# EAGLE design Grove Base HAT For Raspberry Pi Zero (EAGLE 9.2.2)
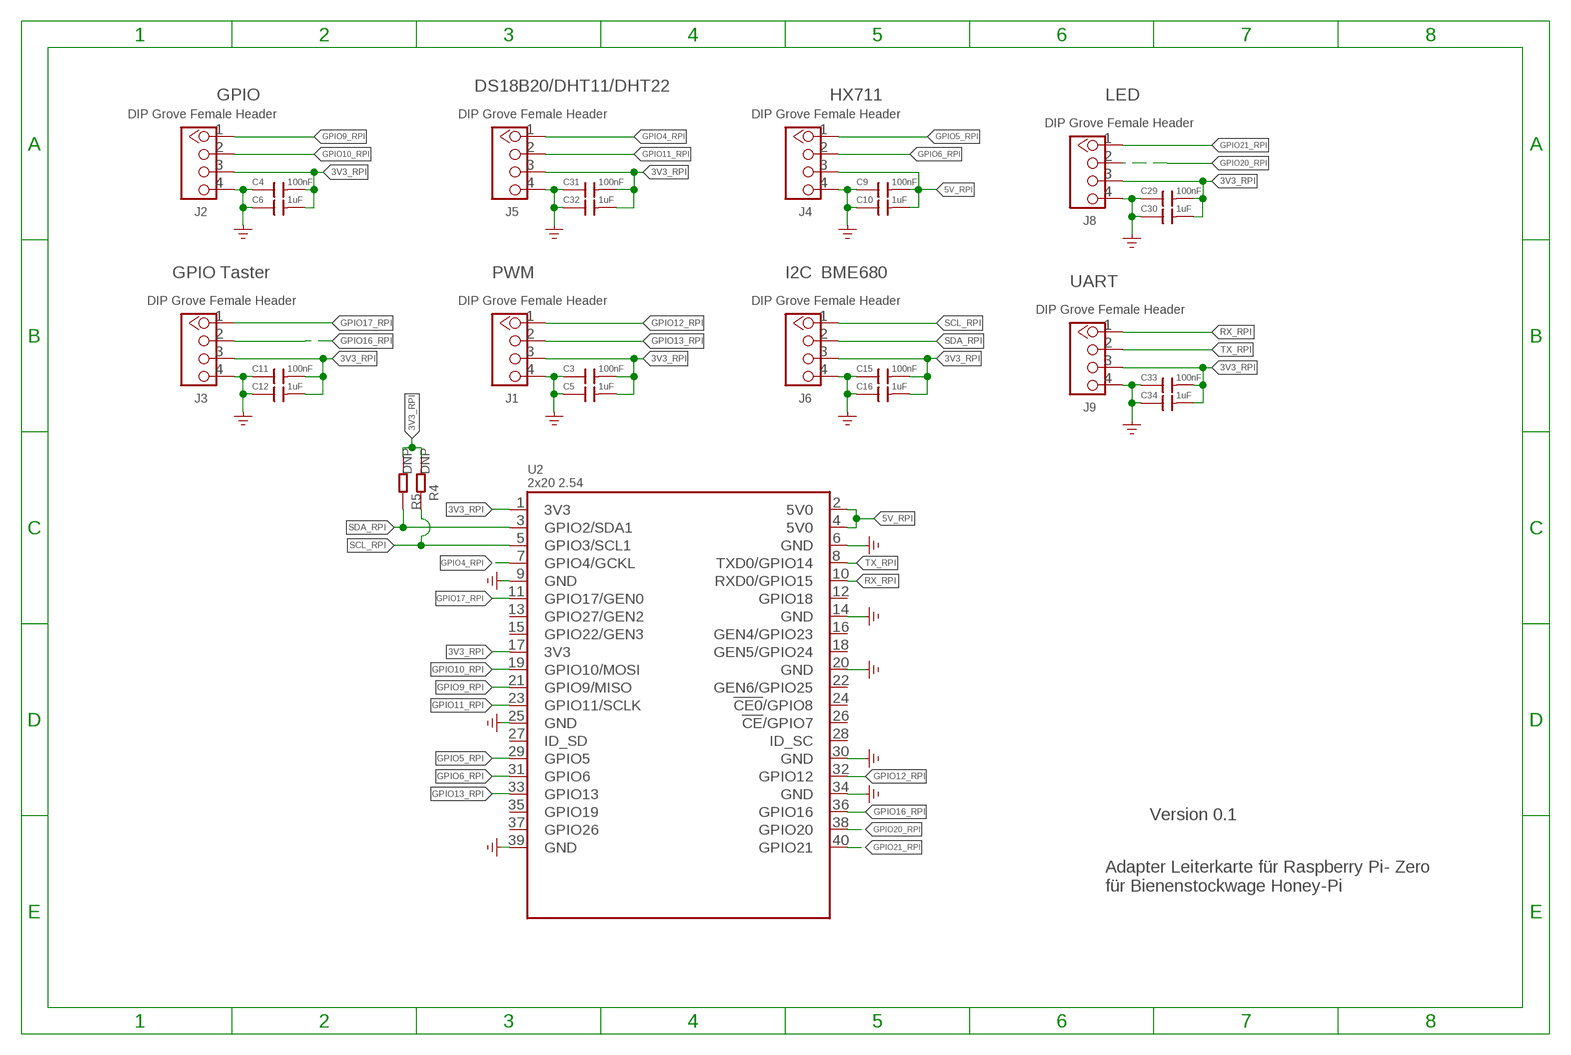
[diagram p0: schematic, sheet 1]

## Parts
C3  100nF  C-0603  [C0603]
C4  100nF  C-0603  [C0603]
C5  1uF  C-0603  [C0603]
C6  1uF  C-0603  [C0603]
C9  100nF  C-0603  [C0603]
C10  1uF  C-0603  [C0603]
C11  100nF  C-0603  [C0603]
C12  1uF  C-0603  [C0603]
C15  100nF  C-0603  [C0603]
C16  1uF  C-0603  [C0603]
C29  100nF  C-0603  [C0603]
C30  1uF  C-0603  [C0603]
C31  100nF  C-0603  [C0603]
C32  1uF  C-0603  [C0603]
C33  100nF  C-0603  [C0603]
C34  1uF  C-0603  [C0603]
J1  DIP Grove Female Header  GROVE-CONNECTOR-DIP-2.0  [HW4-2.0]
J2  DIP Grove Female Header  GROVE-CONNECTOR-DIP-2.0  [HW4-2.0]
J3  DIP Grove Female Header  GROVE-CONNECTOR-DIP-2.0  [HW4-2.0]
J4  DIP Grove Female Header  GROVE-CONNECTOR-DIP-2.0  [HW4-2.0]
J5  DIP Grove Female Header  GROVE-CONNECTOR-DIP-2.0  [HW4-2.0]
J6  DIP Grove Female Header  GROVE-CONNECTOR-DIP-2.0  [HW4-2.0]
J8  DIP Grove Female Header  GROVE-CONNECTOR-DIP-2.0  [HW4-2.0]
J9  DIP Grove Female Header  GROVE-CONNECTOR-DIP-2.0  [HW4-2.0]
R4  DNP  R-0603  [R0603]
R5  DNP  R-0603  [R0603]
U2  2x20 2.54  RPI-ZERO-65X30  [RASPBERRYPI_BASTELSTUBE_V13_RASPI_BOARD_B+_FULL]

## Nets
3V3_RPI: C3.2 C4.2 C5.2 C6.2 C11.2 C12.2 C15.2 C16.2 C29.2 C30.2 C31.2 C32.2 C33.2 C34.2 J1.3 J2.3 J3.3 J5.3 J6.3 J8.3 J9.3 R4.2 R5.2 U2.1(3V3) U2.17(3V3)
5V_RPI: C9.2 C10.2 J4.3 U2.2(5V0) U2.4(5V0)
GND: C3.1 C4.1 C5.1 C6.1 C9.1 C10.1 C11.1 C12.1 C15.1 C16.1 C29.1 C30.1 C31.1 C32.1 C33.1 C34.1 J1.4 J2.4 J3.4 J4.4 J5.4 J6.4 J8.4 J9.4 U2.6(GND) U2.9(GND) U2.14(GND) U2.20(GND) U2.25(GND) U2.30(GND) U2.34(GND) U2.39(GND) ; supply symbol labelled GND_POWER
GPIO4_RPI: J5.1 U2.7(GPIO4/GCKL)
GPIO5_RPI: J4.1 U2.29(GPIO5)
GPIO6_RPI: J4.2 U2.31(GPIO6)
GPIO9_RPI: J2.1 U2.21(GPIO9/MISO)
GPIO10_RPI: J2.2 U2.19(GPIO10/MOSI)
GPIO11_RPI: J5.2 U2.23(GPIO11/SCLK)
GPIO12_RPI: J1.1 U2.32(GPIO12)
GPIO13_RPI: J1.2 U2.33(GPIO13)
GPIO16_RPI: J3.2 U2.36(GPIO16)
GPIO17_RPI: J3.1 U2.11(GPIO17/GEN0)
GPIO20_RPI: J8.2 U2.38(GPIO20)
GPIO21_RPI: J8.1 U2.40(GPIO21)
RX_RPI: J9.1 U2.10(RXD0/GPIO15)
SCL_RPI: J6.1 R4.1 U2.5(GPIO3/SCL1)
SDA_RPI: J6.2 R5.1 U2.3(GPIO2/SDA1)
TX_RPI: J9.2 U2.8(TXD0/GPIO14)
Unconnected: U2.12(GPIO18) U2.13(GPIO27/GEN2) U2.15(GPIO22/GEN3) U2.16(GEN4/GPIO23) U2.18(GEN5/GPIO24) U2.22(GEN6/GPIO25) U2.24(!CE0!/GPIO8) U2.26(!CE!/GPIO7) U2.27(ID_SD) U2.28(ID_SC) U2.35(GPIO19) U2.37(GPIO26)

## Notes on the sheet
- DS18B20/DHT11/DHT22
- GPIO | HX711 | LED
- GPIO | Taster | PWM | I2C | BME680
- UART
- Version 0.1
- Adapter Leiterkarte für Raspberry Pi- Zero
  für Bienenstockwage Honey-Pi

## Library data of the parts
C3-C6 C9-C12 C15 C16 C29-C34 = Discrete-small:C*: Ceramic Capacitors
J1-J6 J8 J9 = Connector-new:GROVE-CONNECTOR-DIP: 4P-2.0:320110033;4P-2.0-90D:320110034
R4 R5 = Discrete-small:R*
U2 = IC-new:RPI-ZERO

## Board
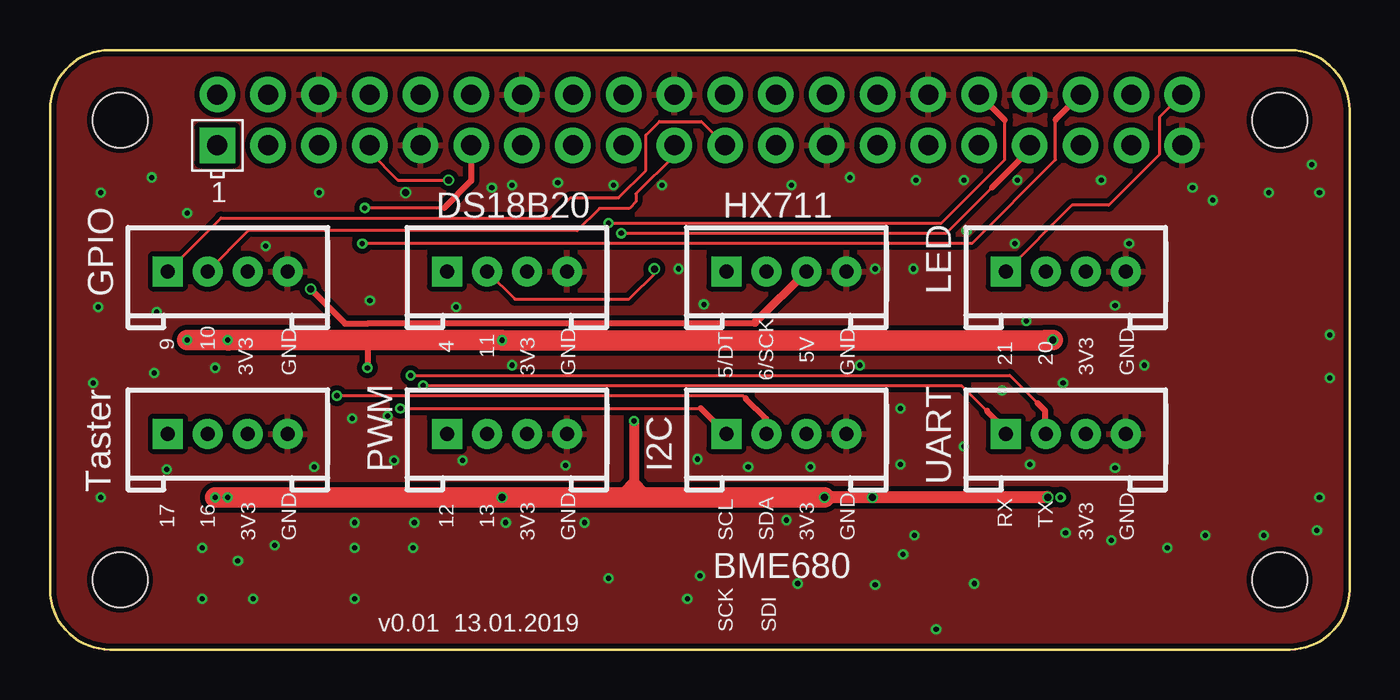
[diagram p1: board, top side]
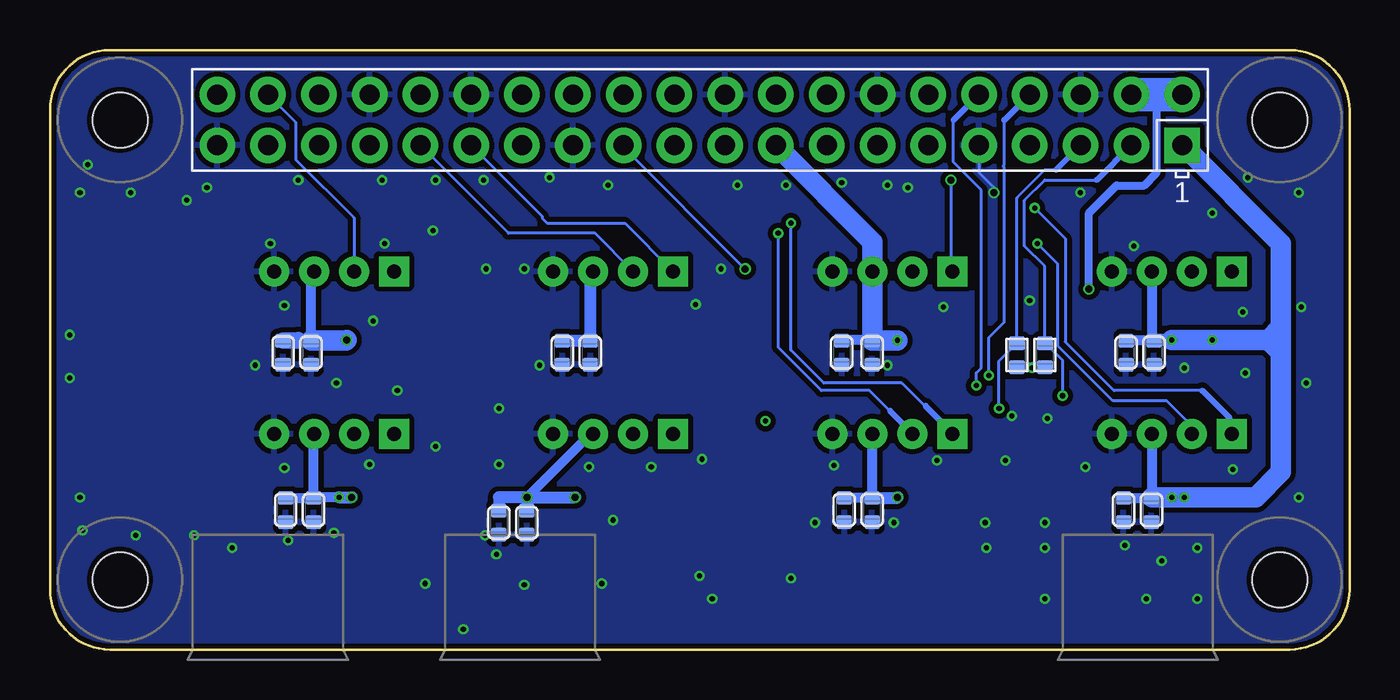
[diagram p2: board, bottom side, seen from below]

Size 65 x 30 mm. Coordinates in mm from the lower left corner, seen from the top.
Copper layers (1*16): Top 0.035mm / dielectric 1.5mm / Bottom 0.035mm
Design rules "SeeedStudio_2layer_DRU_no_angle_20140221 *": minimum track width 1mil, minimum drill 10mil, track to track 6mil, track to pad 6mil, pad to pad 6mil, via to via 6mil, smd to smd 0mil, copper to edge 10mil, drill to drill 10mil, minimum pad ring 4mil, minimum via ring 4mil, stop-mask expansion 2mil, vias tented up to drill 25mil, thermal gap 10mil

### Footprints (pad centres in the part's own frame; a part is rotated, then mirrored left to right if it is on the bottom)
C0603 = smd 0.762 x 0.696: 1 0,0.602; 2 0,-0.602
HW4-2.0 = drill 0.7 pad 1.5 square: 1 -3,0 | drill 0.7 pad 1.5: 2 -1,0; 3 1,0; 4 3,0
R0603 = smd 0.762 x 0.696: 1 0,0.602; 2 0,-0.602
RASPBERRYPI_BASTELSTUBE_V13_RASPI_BOARD_B+_FULL = drill 1 pad 1.778 square: 1 8.37,25.23 | drill 1 pad 1.778: 2 8.37,27.77; 3 10.91,25.23; 4 10.91,27.77; 5 13.45,25.23; 6 13.45,27.77; 7 15.99,25.23; 8 15.99,27.77; 9 18.53,25.23; 10 18.53,27.77; 11 21.07,25.23; 12 21.07,27.77; 13 23.61,25.23; 14 23.61,27.77; 15 26.15,25.23; 16 26.15,27.77; 17 28.69,25.23; 18 28.69,27.77; 19 31.23,25.23; 20 31.23,27.77; 21 33.77,25.23; 22 33.77,27.77; 23 36.31,25.23; 24 36.31,27.77; 25 38.85,25.23; 26 38.85,27.77; 27 41.39,25.23; 28 41.39,27.77; 29 43.93,25.23; 30 43.93,27.77; 31 46.47,25.23; 32 46.47,27.77; 33 49.01,25.23; 34 49.01,27.77; 35 51.55,25.23; 36 51.55,27.77; 37 54.09,25.23; 38 54.09,27.77; 39 56.63,25.23; 40 56.63,27.77 | hole 2.75: 3.5,3.5; 3.5,26.5; 61.5,3.5; 61.5,26.5

### Placement (x,y rotation side)
C3  25.27,6.99 180 bottom
C4  11.18,14.86 180 bottom
C5  23.88,6.99 180 bottom
C6  9.78,14.86 180 bottom
C9  39.37,14.86 180 bottom
C10  37.97,14.86 180 bottom
C11  11.3,6.99 180 bottom
C12  9.91,6.99 180 bottom
C15  41.15,6.35 180 bottom
C16  42.55,6.35 180 bottom
C29  53.34,14.86 180 bottom
C30  51.94,14.86 180 bottom
C31  25.4,14.86 180 bottom
C32  23.88,14.86 180 bottom
C33  53.21,6.99 180 bottom
C34  51.82,6.99 180 bottom
J1  22.86,10.79 0 top
J2  8.89,18.92 0 top
J3  8.89,10.79 0 top
J4  36.83,18.92 0 top
J5  22.86,18.92 0 top
J6  36.83,10.79 0 top
J8  50.8,18.92 0 top
J9  50.8,10.79 0 top
R4  16.64,14.73 0 bottom
R5  15.24,14.73 0 bottom
U2  0,0 0 top

### Tracks (layer width: path | path; a pad name or v marks a point on that pad's centre or on a via)
3V3_RPI  (via drill 0.25 pad 0.51, 0.35)
  Top 0.305: 15.88,15.49 v15.88,14.1
  Top 0.508: v29.21,11.43 29.21,8.38 | 29.21,7.62 29.21,8.38 | 29.21,8.38 28.7,7.87 | 29.21,8.38 29.72,7.87
  Top 0.61: v49.91,7.62 v38.73,7.62
  Top 1.016: v8.89,15.49 v6.86,15.49 | v8.26,7.62 v8.89,7.62 v22.61,7.62 29.21,7.62 v38.73,7.62 | v8.89,15.49 8.91,15.47 | v50.16,15.49 49.78,15.49 49.76,15.47 v22.61,15.47 22.59,15.49 16.21,15.49 15.88,15.49 | v8.89,15.49 15.88,15.49 | 15.88,15.49
  Bottom 0.152: 41.15,7.11 C15.2
  Bottom 0.508: U2.1 8.34,25.23 | R4.2 15.91,14.13 v15.88,14.1 15.84,14.13 R5.2 | v8.89,15.49 9.02,15.49 | 9.75,15.49 C6.2 | C6.2 C4.2 | J2.3 9.89,15.57 C6.2 | J8.3 51.94,18.78 C30.2 51.98,15.49 52.58,15.49 | 9.87,7.62 C12.2 | C11.2 C12.2 | J3.3 9.89,7.6 C12.2 | J1.3 23.86,7.7 23.84,7.68 23.84,7.62 | C5.2 C3.2 | J6.3 37.97,10.79 v41.15,7.62 | C34.2 51.82,10.78 J9.3 | C33.2 C34.2 | v50.55,7.62 51.78,7.62 C34.2 | 23.84,7.62 23.75,7.62 23.78,7.59 C5.2 | 23.84,7.62 C5.2 | 23.86,15.48 25.38,15.48 C31.2
  Bottom 0.61: C5.2 22.64,7.59 v22.61,7.62 | v41.15,7.62 41.15,7.11 | v41.15,7.62 42.55,7.62 C16.2 | v41.15,7.62 v38.73,7.62 | v8.89,15.49 9.75,15.49 | v50.55,7.62 v49.91,7.62
  Bottom 0.813: 52.58,15.49 52.61,15.46 C29.2
  Bottom 1.016: 8.34,25.23 3.43,20.32 3.43,16.13 | 3.43,16.13 3.43,15.75 | 3.43,15.75 3.43,15.24 | 3.43,15.24 3.43,14.86 | 3.43,14.86 3.43,8.89 4.7,7.62 v8.89,7.62 9.87,7.62 | 4.06,15.49 v6.86,15.49 v8.89,15.49 | 4.06,15.49 3.68,15.49 | 3.68,15.49 3.43,15.75 | 3.68,15.49 3.43,15.24 | U2.17 23.86,20.4 J5.3 23.86,15.48 C32.2 23.86,15.47 v22.61,15.47 | 3.43,16.13 4.06,15.49 | 4.06,15.49 3.43,14.86 | v50.16,15.49 50.2,15.46 C30.2
5V_RPI  (via drill 0.35)
  Top 0.305: 35.27,16.36 35.21,16.31 15.88,16.31 15.87,16.31 14.75,16.31 v13.03,18.03
  Top 0.406: J4.3 35.27,16.36
  Bottom 0.152: 9.78,27.77 9.78,27.43
  Bottom 0.406: C9.2 39.34,15.49 | v13.03,18.03 13.03,21.84 11.65,23.22 10.27,23.22 9.66,23.82 9.66,27.32 9.78,27.43
  Bottom 0.61: J4.3 37.97,18.78 C10.2 C9.2
  Bottom 1.676: U2.4 9.78,27.77 U2.2
GND  (via drill 0.25 pad 0.51, 0.35)
  Bottom 0.152: 23.84,6.35 C5.1 | 25.86,9.29 v25.78,9.21 | U2.9 18.53,23.86 17.78,23.11 v17.78,22.86
  Bottom 0.406: C16.1 43.21,5.75 v43.24,5.71
  Bottom 0.508: 26.7,6.38 v26.73,6.35
  other vias: 11.24,5.21 18.16,5.08 44.32,1.02 36.83,6.48 15.11,11.56 40.51,14.22 54.74,14.22 53.09,5.46 27.94,3.56 9.4,4.45 7.62,5.08 5.84,9.02 5.21,13.84 2.16,13.34 2.54,7.62 2.41,17.14 2.54,22.86 5.08,23.62 15.24,5.08 10.16,2.54 15.24,2.54 7.62,2.54 31.88,2.54 32.51,3.68 37.4,3.3 41.27,3.24 42.67,4.76 46.23,3.3 50.8,5.84 55.88,5.08 60.71,5.71 57.78,5.71 63.37,5.97 63.5,7.62 63.12,24.26 58.17,22.48 60.96,22.86 63.5,22.86 57.15,23.11 52.58,23.5 23.11,23.24 25.4,23.37 28.19,23.24 30.61,23.24 37.08,23.24 10.79,20.19 13.46,22.86 8.26,14.1 16.89,11.68 20.64,9.46 38.04,9.14 42.55,9.27 45.72,10.16 49.02,9.27 53.28,9.08 53.28,17.21 48.83,16.45 48.26,20.32 31.43,19.05 32.7,17.27 20.32,17.14 22.1,23.11 16,17.46 17.21,9.46 23.11,14.22 64.01,13.59 64.01,15.75 43.31,23.5 45.72,23.5 48.39,23.5 6.86,21.84 50.67,13.34 5.33,16.89 13.21,9.14 47.62,12.95 32.38,9.53 34.92,9.14 42.55,12.06 22.8,6.35 18.22,6.35 15.24,6.35 45.85,20.95 53.98,20.32 41.27,19.05 43.18,19.05 40.01,23.62
  pour Bottom (isolate 0.254, rank 6): -0.64,30.48 65.41,30.48 65.41,-0.64 1.91,-0.64 1.91,-1.27 -0.64,-1.27
  pour Top (isolate 0.254, rank 6): -0.64,30.48 65.41,30.48 65.41,-0.64 -0.64,-0.64
GPIO4_RPI  (via drill 0.35)
  Top 0.152: U2.7 15.99,24.9 17.4,23.5 v19.94,23.5 v19.94,23.49
  Bottom 0.152: v19.94,23.49 19.94,19 J5.1
GPIO5_RPI
  Bottom 0.152: U2.29 40.39,21.69 40.39,21.59 40.13,21.34 36.24,21.34 J4.1
GPIO6_RPI
  Bottom 0.152: J4.2 37.73,20.83 42.07,20.83 U2.31
GPIO9_RPI
  Top 0.152: J2.1 8.56,21.59 25.02,21.59 26.04,22.61 28.45,22.61 29.81,23.97 29.81,25.74 30.48,26.42 32.58,26.42 U2.21
GPIO10_RPI
  Top 0.152: J2.2 9.92,20.95 26.37,20.95 27.49,22.07 28.98,22.07 29.31,22.41 29.31,22.8 31.23,24.72 U2.19
GPIO11_RPI  (via drill 0.35)
  Top 0.152: J5.2 23.26,17.53 28.96,17.53 30.35,18.92 v30.23,19.05
  Bottom 0.152: v30.23,19.05 36.31,25.13 U2.23
GPIO12_RPI  (via drill 0.25 pad 0.51)
  Top 0.152: v27.94,21.34 44.58,21.34 47.75,24.51 47.75,26.49
  Top 0.305: U2.32 47.75,26.49
  Bottom 0.152: J1.1 22.4,13.34 26.29,13.34 27.94,14.99 v27.94,21.34
  Bottom 0.305: J1.1 19.86,10.84 21.21,12.19
GPIO13_RPI  (via drill 0.25 pad 0.51)
  Top 0.152: v28.57,20.83 44.83,20.83 47.12,23.11
  Top 0.305: U2.33 49.01,25.01 47.12,23.11
  Bottom 0.152: 22.99,11.94 24,12.95 26.42,12.95 28.57,15.11 v28.57,20.83
  Bottom 0.305: J1.2 21.86,10.81 22.99,11.94
GPIO16_RPI  (via drill 0.25 pad 0.51)
  Top 0.152: v15.62,20.32 46.1,20.32 50.29,24.51 50.29,26.51
  Top 0.305: U2.36 50.29,26.51
  Bottom 0.152: v15.62,20.32 14.61,19.3 14.61,15.22 11.84,12.45 9.14,12.45 8.13,11.43 8.13,11.03 J3.2
GPIO17_RPI  (via drill 0.25 pad 0.51)
  Top 0.152: 19.72,22.1 v15.75,22.1
  Top 0.305: U2.11 21.07,23.45 19.72,22.1
  Bottom 0.152: v15.75,22.1 14.22,20.57 14.22,15.39 11.79,12.95 7.37,12.95 | J3.1 6,10.9 6,11.59
  Bottom 0.305: 6,11.59 7.37,12.95
GPIO20_RPI
  Bottom 0.152: U2.38 52.7,26.39 52.7,24.51 49.8,21.61 J8.2
GPIO21_RPI
  Top 0.152: U2.40 55.5,26.64 55.5,24.77 52.96,22.23 51.1,22.23 J8.1
RX_RPI  (via drill 0.25 pad 0.51)
  Top 0.152: v18.67,13.21 45.59,13.21 46.86,11.94
  Top 0.305: J9.1 47.8,11 46.86,11.94
  Bottom 0.152: 19.81,26.49 19.81,24.38 18.41,22.99 18.41,14.1 18.67,13.84 v18.67,13.21
  Bottom 0.305: U2.10 19.81,26.49
SCL_RPI  (via drill 0.25 pad 0.51)
  Top 0.152: v17.53,12.06 32.56,12.06
  Top 0.305: 32.56,12.06 J6.1
  Bottom 0.152: 14.68,24 15.24,24 16.64,22.61 R4.1 17.53,14.45 v17.53,12.06
  Bottom 0.305: U2.5 14.68,24
SDA_RPI  (via drill 0.25 pad 0.51)
  Top 0.152: v14.35,12.7 34.67,12.7 34.8,12.57 35.81,11.56 35.81,10.81 J6.2
  Top 0.305: J6.2 35.83,11.54 34.8,12.57
  Bottom 0.152: 12.64,23.5 15.24,23.5 16.26,22.48 16.26,20.19 15.24,19.18 R5.1 15.21,15.33 14.35,14.48 v14.35,12.7
  Bottom 0.305: U2.3 12.64,23.5
TX_RPI  (via drill 0.25 pad 0.51)
  Top 0.152: v18.03,13.72 48.01,13.72 49.4,12.32 | 49.78,10.81 J9.2
  Top 0.305: 49.78,10.81 49.78,11.94 49.4,12.32
  Bottom 0.152: 17.27,26.49 17.27,24.26 17.34,24.19 17.27,24.13 17.27,16.38 18.03,15.62 v18.03,13.72
  Bottom 0.305: U2.8 17.27,26.49

### Text on the board
tPlace: DS18B20 | HX711 | GPIO | LED | 9 | 10 | 4 | 11 | 3V3 | GND | 3V3 | GND | 5/DT | 5V | GND | 21 | 20 | 3V3 | GND | 6/SCK | PWM | I2C | Taster | UART | 17 | 16 | 12 | 13 | RX | TX | 3V3 | GND | 3V3 | GND | SCL | SDA | 3V3 | GND | 3V3 | GND | BME680 | v0.01 13.01.2019 | SCK | SDI
bTest: U2